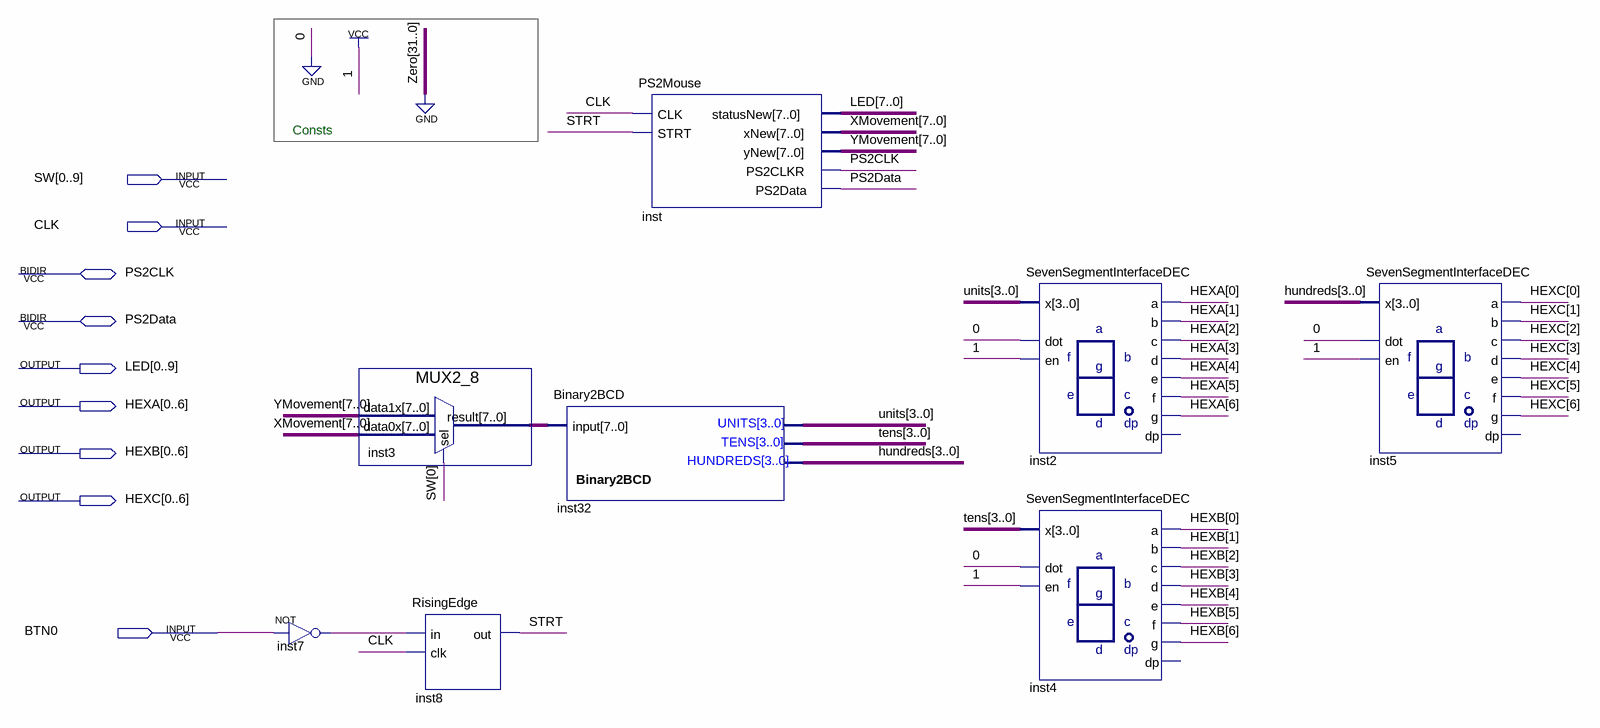
[diagram p0: schematic sheet]
// Quartus schematic PS2Test.bdf as structural Verilog: 8 symbols, 9 pins
module PS2Test (
  input  [0:9] SW,
  input  CLK,
  input  BTN0,
  inout  PS2CLK,
  inout  PS2Data,
  output [0:9] LED,
  output [0:6] HEXA,
  output [0:6] HEXB,
  output [0:6] HEXC
);

  wire inst7_out, STRT;
  wire [3:0] hundreds, tens, units;
  wire [7:0] inst3_result, XMovement, YMovement;

  not inst7 (inst7_out, BTN0);
  MUX2_8 inst3 (.data1x(YMovement), .data0x(XMovement), .sel(SW[0]), .result(inst3_result));
  RisingEdge inst8 (.in(inst7_out), .clk(CLK), .out(STRT));
  Binary2BCD inst32 (.\input (inst3_result), .bcd_hundreds(hundreds), .bcd_tens(tens), .bcd_units(units));
  PS2Mouse inst (
    .CLK(CLK), .STRT(STRT), .statusNew({LED[7], LED[6], LED[5], LED[4], LED[3], LED[2], LED[1], LED[0]}),
    .xNew(XMovement), .yNew(YMovement), .PS2CLKR(PS2CLK), .PS2Data(PS2Data));
  SevenSegmentInterfaceDEC inst2 (
    .dot(1'b0), .en(1'b1), .x(units), .a(HEXA[0]), .b(HEXA[1]), .c(HEXA[2]), .d(HEXA[3]), .e(HEXA[4]),
    .f(HEXA[5]), .g(HEXA[6]));  // open: dp
  SevenSegmentInterfaceDEC inst4 (
    .dot(1'b0), .en(1'b1), .x(tens), .a(HEXB[0]), .b(HEXB[1]), .c(HEXB[2]), .d(HEXB[3]), .e(HEXB[4]),
    .f(HEXB[5]), .g(HEXB[6]));  // open: dp
  SevenSegmentInterfaceDEC inst5 (
    .dot(1'b0), .en(1'b1), .x(hundreds), .a(HEXC[0]), .b(HEXC[1]), .c(HEXC[2]), .d(HEXC[3]), .e(HEXC[4]),
    .f(HEXC[5]), .g(HEXC[6]));  // open: dp

  // Notes on the sheet:
  //   Consts
endmodule
